# Altium schematic sheet Ax2WDRobot.SchDoc
size A3; SheetNumber: 1; SheetTotal: 5
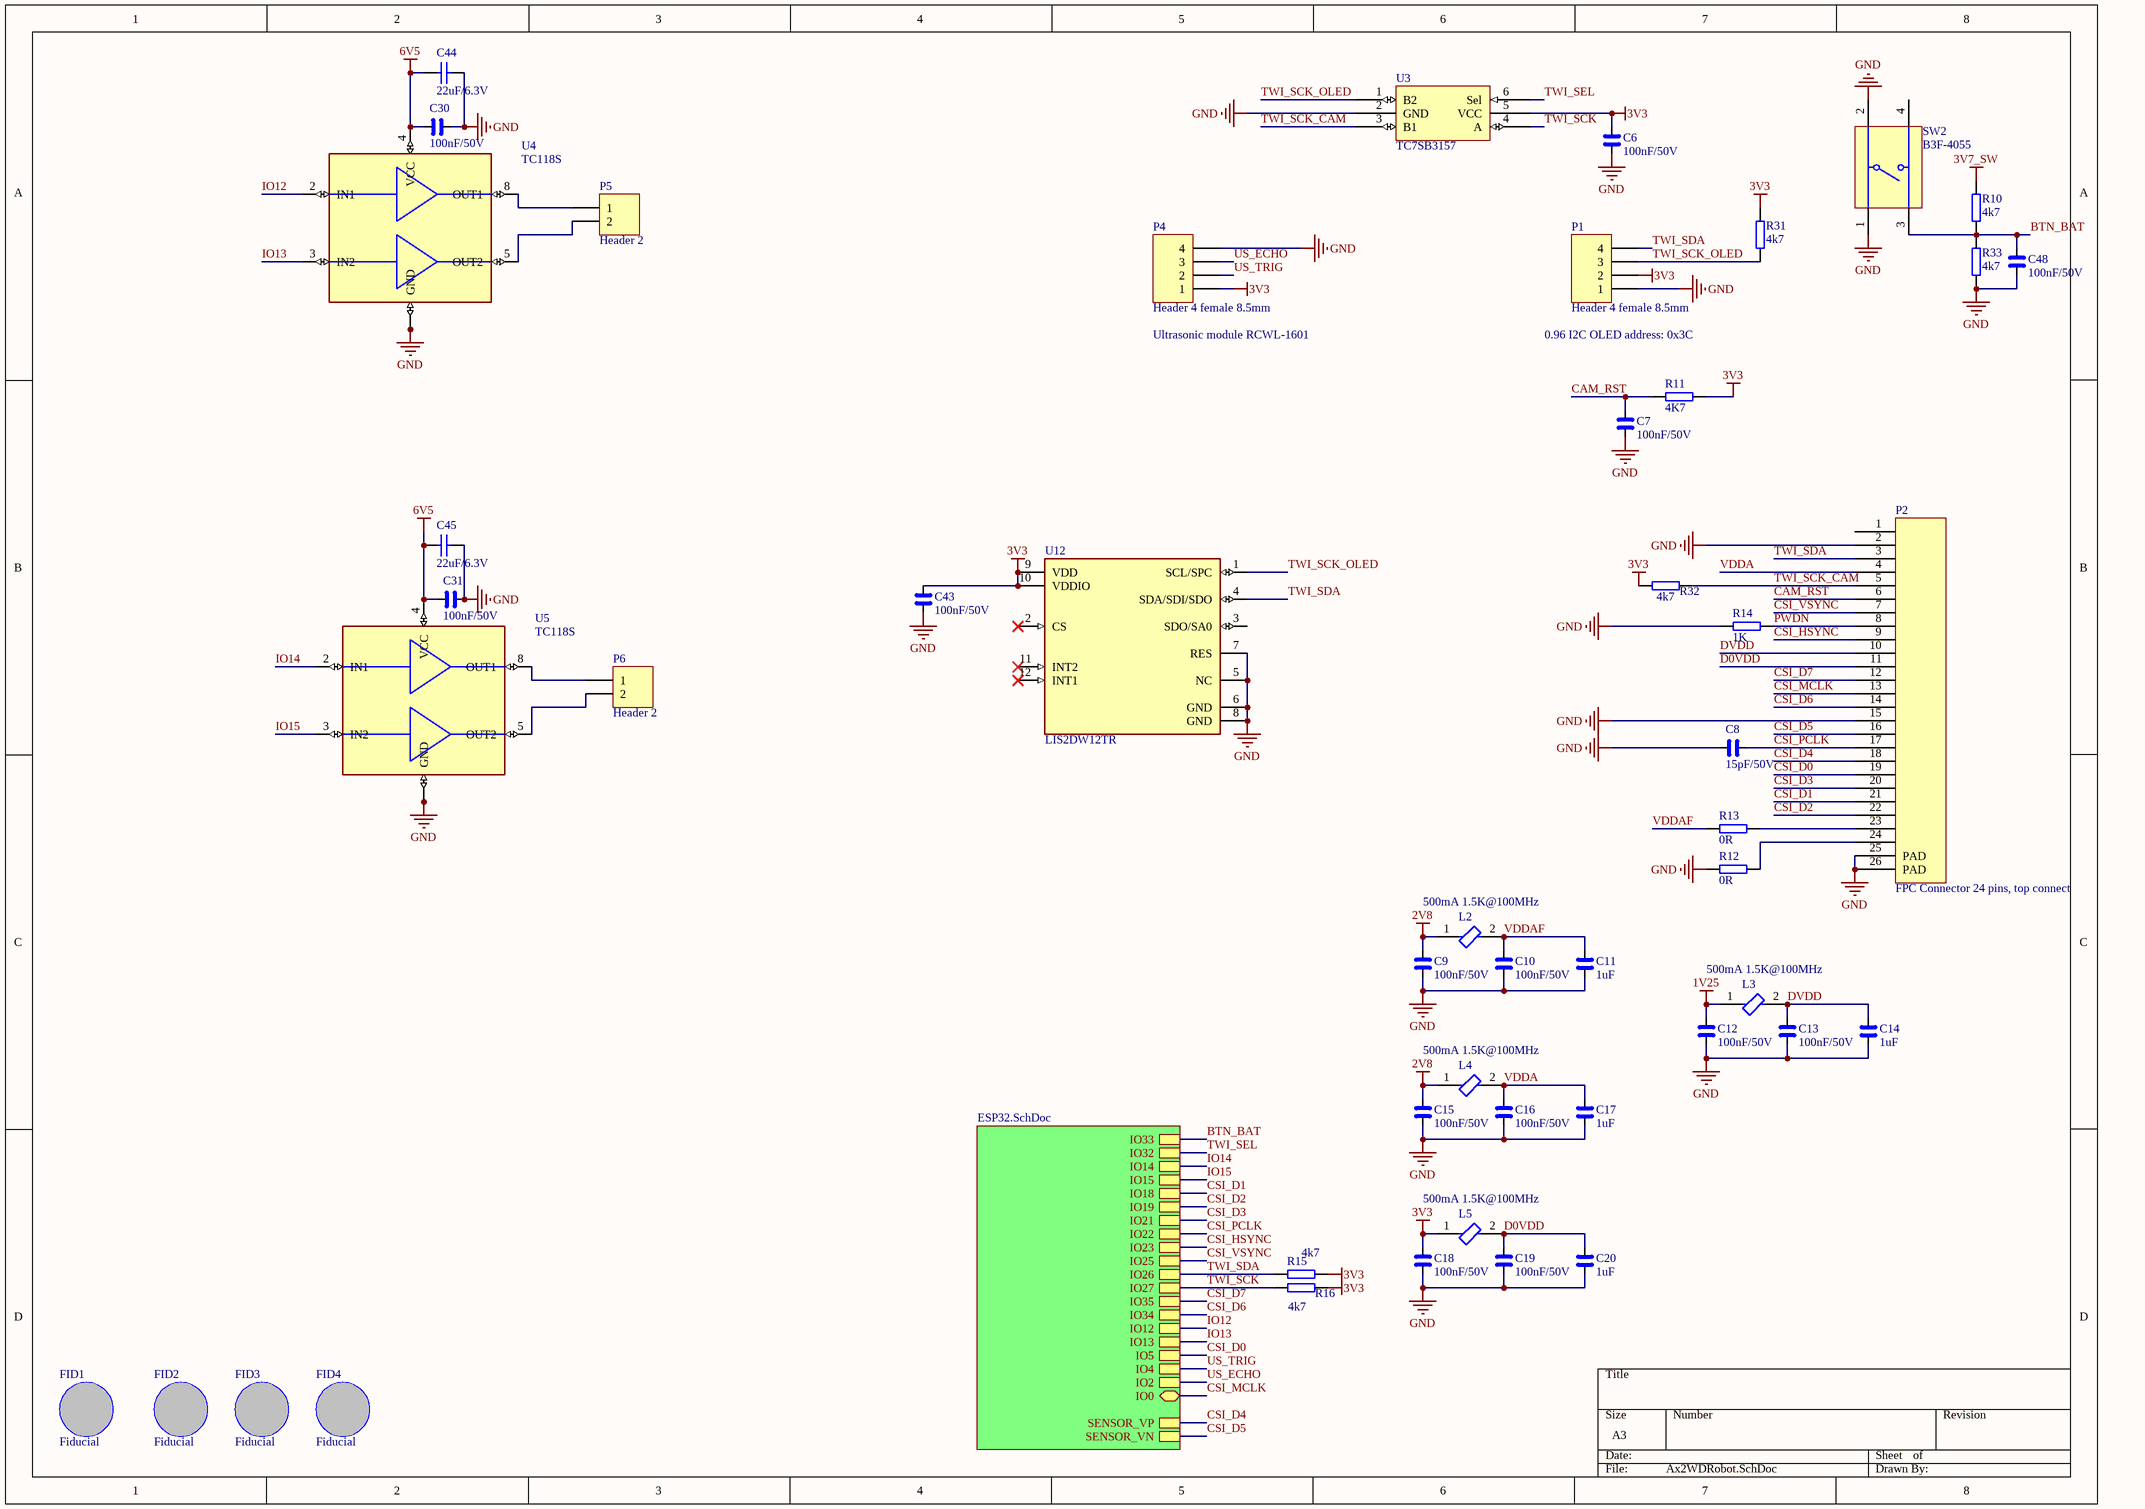
[diagram p0: Ax2WDRobot.SchDoc]

## Parts
C6  100nF/50V  [1608[0603]]
C7  100nF/50V  [1608[0603]]
C8  15pF/50V  [1608[0603]]
C9  100nF/50V  [1608[0603]]
C10  100nF/50V  [1608[0603]]
C11  1uF  [1608[0603]]
C12  100nF/50V  [1608[0603]]
C13  100nF/50V  [1608[0603]]
C14  1uF  [1608[0603]]
C15  100nF/50V  [1608[0603]]
C16  100nF/50V  [1608[0603]]
C17  1uF  [1608[0603]]
C18  100nF/50V  [1608[0603]]
C19  100nF/50V  [1608[0603]]
C20  1uF  [1608[0603]]
C30  100nF/50V  [1608[0603]]
C31  100nF/50V  [1608[0603]]
C43  100nF/50V  [1608[0603]]
C44  22uF/6.3V  [1608[0603]]
C45  22uF/6.3V  [1608[0603]]
C48  100nF/50V  [1608[0603]]
FID1  Fiducial  [FIDUCIAL_POLY]  (no BOM)
FID2  Fiducial  [FIDUCIAL_POLY]  (no BOM)
FID3  Fiducial  [FIDUCIAL_POLY]  (no BOM)
FID4  Fiducial  [FIDUCIAL_POLY]  (no BOM)
L2  500mA 1.5K@100MHz  [1608[0603]]
L3  500mA 1.5K@100MHz  [1608[0603]]
L4  500mA 1.5K@100MHz  [1608[0603]]
L5  500mA 1.5K@100MHz  [1608[0603]]
P1  Header 4 female 8.5mm  [BCS-104-L-S-TE]
P2  FPC Connector 24 pins, top connect  [AFC07-S24ECA-00]
P4  Header 4 female 8.5mm  [BCS-104-L-S-TE]
P5  Header 2  [BCS-102-L-S-TE]
P6  Header 2  [BCS-102-L-S-TE]
R10  4k7  [1608[0603]]
R11  4K7  [1608[0603]]
R12  0R  [1608[0603]]  (no BOM)
R13  0R  [1608[0603]]  (no BOM)
R14  1K  [1608[0603]]
R15  4k7  [1608[0603]]
R16  4k7  [1608[0603]]
R31  4k7  [1608[0603]]
R32  4k7  [1608[0603]]
R33  4k7  [1608[0603]]
SW2  B3F-4055  [OMRON-B3F-4055_AX]
U3  TC7SB3157  [SOT-363_MP6D]
U4  TC118S  [SO08]
U5  TC118S  [SO08]
U12  LIS2DW12TR  [FP-LGA12-DM00170568-MFG]

## Sub-sheets
? = ESP32.SchDoc: IO2, IO5, IO34, IO35, IO27, IO26, IO25, IO23, IO22, IO21, IO19, IO18, IO15, SENSOR_VP, SENSOR_VN, IO0 (bidir), IO4, IO33, IO32, IO12, IO13, IO14

## Nets
1V25: C12.2 L3.1
2V8: C9.2 C15.2 L2.1 L4.1
3V3: C6.1 C18.2 C43.1 L5.1 P1.2 P4.1 R11.2 R15.1 R16.1 R31.2 R32.2 U3.5(VCC) U12.9(VDD) U12.10(VDDIO)
3V7_SW: R10.2
6V5: C30.2 C31.2 C44.2 C45.2 U4.4(VCC) U5.4(VCC)
GND: C6.2 C7.1 C8.1 C9.1 C10.1 C11.2 C12.1 C13.1 C14.2 C15.1 C16.1 C17.2 C18.1 C19.1 C20.2 C30.1 C31.1 C43.2 C44.1 C45.1 C48.1 P1.1 P2.2 P2.15 P2.25(PAD) P2.26(PAD) P4.4 R12.1 R14.1 R33.1 SW2.1 SW2.2 U3.2(GND) U4.6(GND) U4.7(GND) U5.6(GND) U5.7(GND) U12.5(NC) U12.6(GND) U12.7(RES) U12.8(GND)
BTN_BAT: C48.2 R10.1 R33.2 SW2.3 ; sheet /IO33
CAM_RST: C7.2 P2.6 R11.1
CSI_D0: P2.19 ; sheet /IO5
CSI_D1: P2.21 ; sheet /IO18
CSI_D2: P2.22 ; sheet /IO19
CSI_D3: P2.20 ; sheet /IO21
CSI_D4: P2.18 ; sheet /SENSOR_VP
CSI_D5: P2.16 ; sheet /SENSOR_VN
CSI_D6: P2.14 ; sheet /IO34
CSI_D7: P2.12 ; sheet /IO35
CSI_HSYNC: P2.9 ; sheet /IO23
CSI_MCLK: P2.13 ; sheet /IO0
CSI_PCLK: C8.2 P2.17 ; sheet /IO22
CSI_VSYNC: P2.7 ; sheet /IO25
D0VDD: C19.2 C20.1 L5.2 P2.11
DVDD: C13.2 C14.1 L3.2 P2.10
IO12: U4.2(IN1) ; sheet /IO12
IO13: U4.3(IN2) ; sheet /IO13
IO14: U5.2(IN1) ; sheet /IO14
IO15: U5.3(IN2) ; sheet /IO15
PWDN: P2.8 R14.2
TWI_SCK: R16.2 U3.4(A) ; sheet /IO27
TWI_SCK_CAM: P2.5 R32.1 U3.3(B1)
TWI_SCK_OLED: P1.3 R31.1 U3.1(B2) U12.1(SCL/SPC)
TWI_SDA: P1.4 P2.3 R15.2 U12.4(SDA/SDI/SDO) ; sheet /IO26
TWI_SEL: U3.6(Sel) ; sheet /IO32
US_ECHO: P4.3 ; sheet /IO2
US_TRIG: P4.2 ; sheet /IO4
VDDA: C16.2 C17.1 L4.2 P2.4
VDDAF: C10.2 C11.1 L2.2 R13.1
NetP2_23: P2.23 R13.2
NetP2_24: P2.24 R12.2
NetP5_1: P5.1 U4.8(OUT1)
NetP5_2: P5.2 U4.5(OUT2)
NetP6_1: P6.1 U5.8(OUT1)
NetP6_2: P6.2 U5.5(OUT2)

Not connected (* = marked no-connect by the designer): P2 1; SW2 4; U12 2(CS)* 3(SDO/SA0) 11(INT2)* 12(INT1)*

## Notes on the sheet
- (near P4) Ultrasonic module RCWL-1601
- 0.96 I2C OLED address: 0x3C

## Library data of the parts
C6 C7 C9 C10 C12 C13 C15 C16 C18 C19 C30 C31 C48 = C: Cap Ceramic 0.1uF 50V X7R 20% SMD 0603 125C Paper T/R; Supplier 1: Digi-Key; Supplier Part Number 1: 1276-1941-1-ND; Case/Package: 0603; LCSCPartNo: C14663
C8 = C: Cap Ceramic 0603; Supplier 1: Digi-Key; Case/Package: 0603; LCSCPartNo: C1644
C11 C14 C17 C20 = C: CAP CER 1UF 10V X5R 0603; Supplier 1: Digi-Key; Supplier Part Number 1: 1276-1866-1-ND; Case/Package: 0603; LCSCPartNo: C15849
C43 = C: Cap Ceramic 0.1uF 50V X7R 20% SMD 0603 125C Paper T/R; Manufacturer: Samsung; Manufacturer Part Number: CL10B104MB8NNNC; Supplier 1: Digi-Key; Supplier Part Number 1: 1276-1941-1-ND; Case/Package: 0603; LCSCPartNo: C14663
C44 C45 = Cap: Capacitor; LCSCPartNo: C59461; Case/Package: 0603
L2-L5 = CMP-0686-00368-3: Chip Ferrite Bead, 0603, 1500Ω @ 100MHz, 0.5Ω, 25%, 500mA; Case/Package: 0603; Supplier 1: Digi-Key; Supplier Part Number 1: 490-5216-1-ND; LCSCPartNo: C82155
P1 P4 = Header 4: Header, 4-Pin; Supplier 1: Digi-Key; LCSCPartNo: C124413
P2 = FPC-CONN-24: LCSCPartNo: C262643
P5 P6 = Header 2: Header, 2-Pin; LatestRevisionDate: 17-Jul-2002; LatestRevisionNote: Re-released for DXP Platform.; Publisher: Altium Limited; LCSCPartNo: C49661
R10 R15 R16 R31-R33 = R: RES SMD 4.7K OHM 1% 1/10W 0603; Supplier 1: Digi-Key; Supplier Part Number 1: 311-4.70KHRCT-ND; Case/Package: 0603; LCSCPartNo: C23162
R11-R14 = R: Res General Purpose Thick Film 0603 1% 1/10W ±100ppm/°C Molded SMD Paper T/R; Supplier 1: Digi-Key; Case/Package: 0603
  R11: LCSCPartNo: C23162
  R12 R13: LCSCPartNo: C21189
  R14: LCSCPartNo: C21190
SW2 = CMP-2000-05902-1: Tactile Switch, 1 to 50 mA, 100 mOhm Max, 5 to 24 VDC, -25 to 70 degC, 4-Pin THD, RoHS, Bulk; LCSCPartNo: C84931
U3 = TC7SB3157CFU: 1-of-2 multiplexer/demultiplexer; LCSCPartNo: C2674458; LCSCAltPartNo: C150170
U12 = CMP-12175-000006-1: ACCEL 2-16G I2C/SPI 12LGA; Manufacturer: STMicroelectronics; Min Supply Voltage: 1.62V; Operating Supply Current: 0.38-90uA; Sensor Output: I2C,SPI; Accel Resolution: 14bits; Max Supply Voltage: 3.6V; Accel Range: 2/4/8/16g; Height: 0.7mm; Device Class L1: Sensors; RoHS: TRUE; Temperature Range Low: -40°C; Category: IC; Mouser Description: Accelerometer Triple ±2g/±4g/±8g/±16g 1.62V to 3.6V 0.244mg/digit/0.488mg/digit/0.976mg/digit/1.952mg/digit 12-Pin LG...; Digikey Description: ACCEL 2-16G I2C/SPI 12LGA; ComponentLink2URL: https://www.st.com/resource/en/datasheet/lis2dw12.pdf; Automotive: No; Manufacturer Part Number: LIS2DW12TR; Lead Free: Yes; Footprint Url: https://www.st.com/content/ccc/resource/technical/document/technical_note/73/17/9c/16/dd/96/4a/01/CD00134799.pdf/files/CD00134799.pdf/jcr:content/translations/en.CD00134799.pdf; Temperature: -40°C to +85°C; Device Class L3: Accelerometers; Package: LGA12-DM00170568; Temperature Range High: +85°C; Device Class L2: Motion Sensors; Octopart: https://octopart.com/lis2dw12tr-stmicroelectronics-77080925; ComponentLink2Description: Datasheet; LCSCPartNo: C189624
U4 U5 = TC118S: LCSCPartNo: C88308